# EAGLE design Hydra (EAGLE 6.5.0)
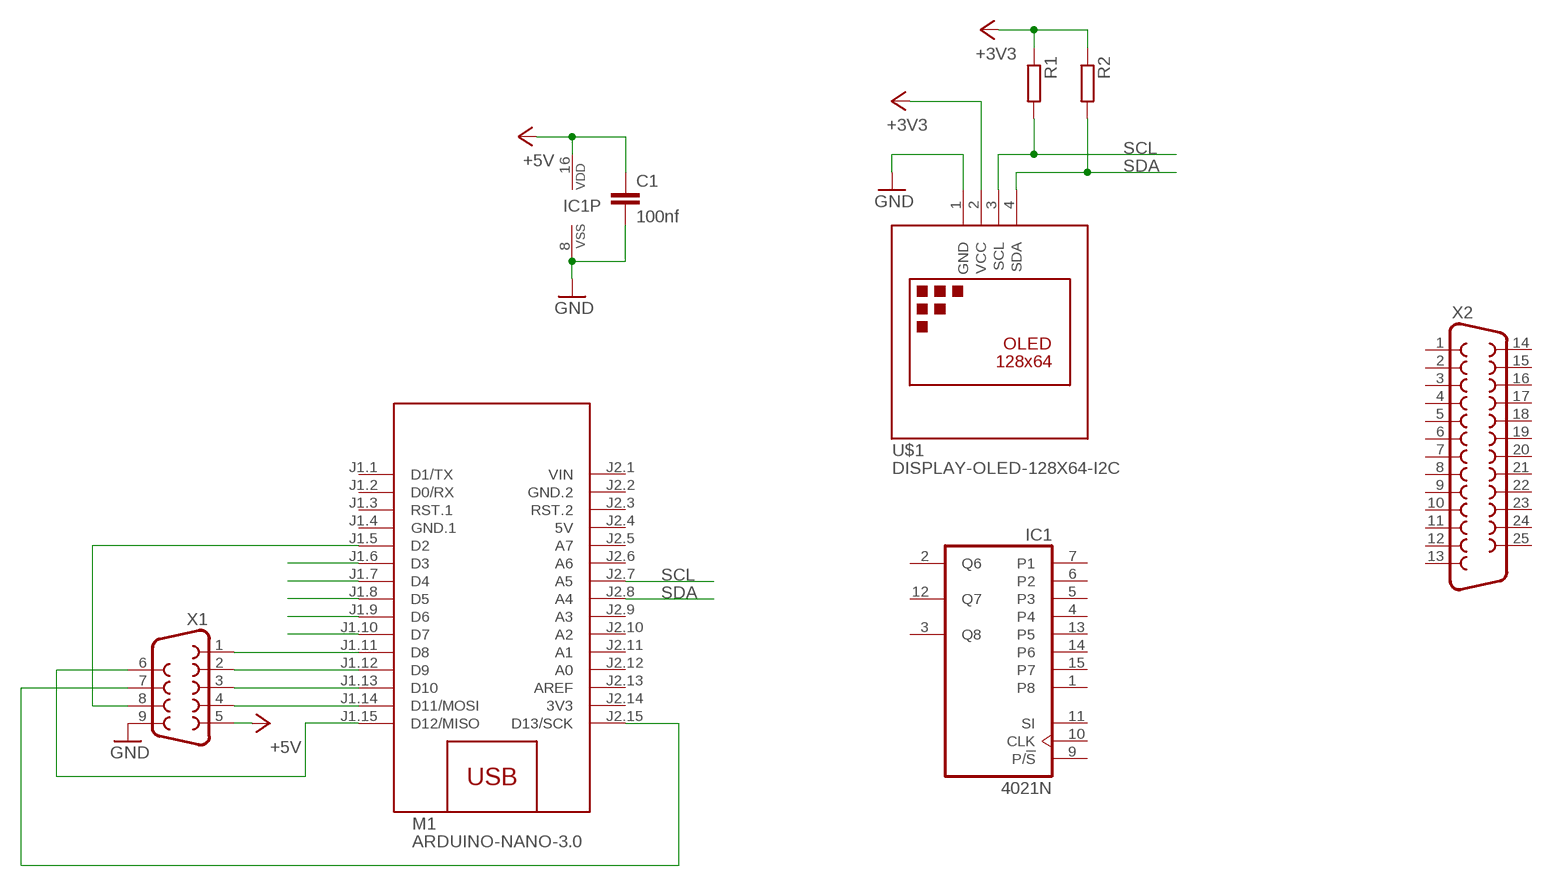
[diagram p0: schematic, sheet 1]

## Parts
C1  100nf  C-EU050-024X044  [C050-024X044]
IC1  4021N  [DIL16]
M1  ARDUINO-NANO-3.0  [ARDUINO-NANO-3.0]
R1  R-EU_0204/5  [0204/5]
R2  R-EU_0204/5  [0204/5]
U$1  DISPLAY-OLED-128X64-I2C  [DISPLAY-OLED-128X64-I2C]
X1  F09D  [F09D]
X2  F25D  [F25D]

## Nets
+3V3: R1.1 R2.1 U$1.2(VCC)
+5V: C1.1 IC1.16(VDD) X1.5
GND: C1.2 IC1.8(VSS) U$1.1(GND) X1.9
N$1: M1.J1.11(D8) X1.1
N$2: M1.J1.12(D9) X1.2
N$3: M1.J1.13(D10) X1.3
N$4: M1.J1.14(D11/MOSI) X1.4
N$5: M1.J1.15(D12/MISO) X1.6
N$6: M1.J2.15(D13/SCK) X1.7
N$7: M1.J1.5(D2) X1.8
N$8: M1.J1.6(D3)
N$9: M1.J1.7(D4)
N$10: M1.J1.8(D5)
N$11: M1.J1.9(D6)
N$12: M1.J1.10(D7)
SCL: M1.J2.7(A5) R1.2 U$1.3(SCL)
SDA: M1.J2.8(A4) R2.2 U$1.4(SDA)
Unconnected: IC1.1(P8) IC1.2(Q6) IC1.3(Q8) IC1.4 IC1.5(P3) IC1.6(P2) IC1.7(P1) IC1.9(P/!S) IC1.10(CLK) IC1.11(SI) IC1.12(Q7) IC1.13(P5) IC1.14(P6) IC1.15(P7) M1.J1.1(D1/TX) M1.J1.2(D0/RX) M1.J1.3(RST.1) M1.J2.3(RST.2) M1.J2.5(A7) M1.J2.6(A6) M1.J2.9(A3) M1.J2.10(A2) M1.J2.11(A1) M1.J2.12(A0) M1.J2.13(AREF) X2.1 X2.2 X2.3 X2.4 X2.5 X2.6 X2.7 X2.8 X2.9 X2.10 X2.11 X2.12 X2.13 X2.14 X2.15 X2.16 X2.17 X2.18 X2.19 X2.20 X2.21 X2.22 X2.23 X2.24 X2.25

## Power pins joined to a net without a drawn wire
3V3: M1.J2.14(3V3)
5V: M1.J2.4(5V)
GND.1: M1.J1.4(GND.1)
GND.2: M1.J2.2(GND.2)
VIN: M1.J2.1(VIN)

## Library data of the parts
C1 = rcl:C-EU: CAPACITOR, European symbol
IC1 = 40xx:4021: 8-bit static SHIFT REGISTER
M1 = diy-modules:ARDUINO-NANO-3.0: Arduino Nano 3.0 and compatible devices More details available here: https://www.arduino.cc/en/Main/ArduinoBoardNano Click here to find device on ebay.com <http://www.ebay.com/sch/arduino+nano>
R1 R2 = rcl:R-EU_: RESISTOR, European symbol
U$1 = diy-modules:DISPLAY-OLED-128X64-I2C: 128x64 Dot Matrix OLED Module based on SSD1306 chip Variant with I2C interface More details available here: http://www.instructables.com/id/Monochrome-096-i2c-OLED-display-with-arduino-SSD13/ SSD1306 datasheet: https://cdn-shop.adafruit.com/datasheets/SSD1306.pdf Click here to find device on ebay.com <http://www.ebay.com/sch/oled+display+128x64+iic> Note: There are two variants: I2C and SPI. Search for the proper version.
X1 = con-subd:F09: SUB-D; OC_FARNELL: unknown; OC_NEWARK: unknown
X2 = con-subd:F25: SUB-D; OC_FARNELL: unknown; OC_NEWARK: unknown

## Board
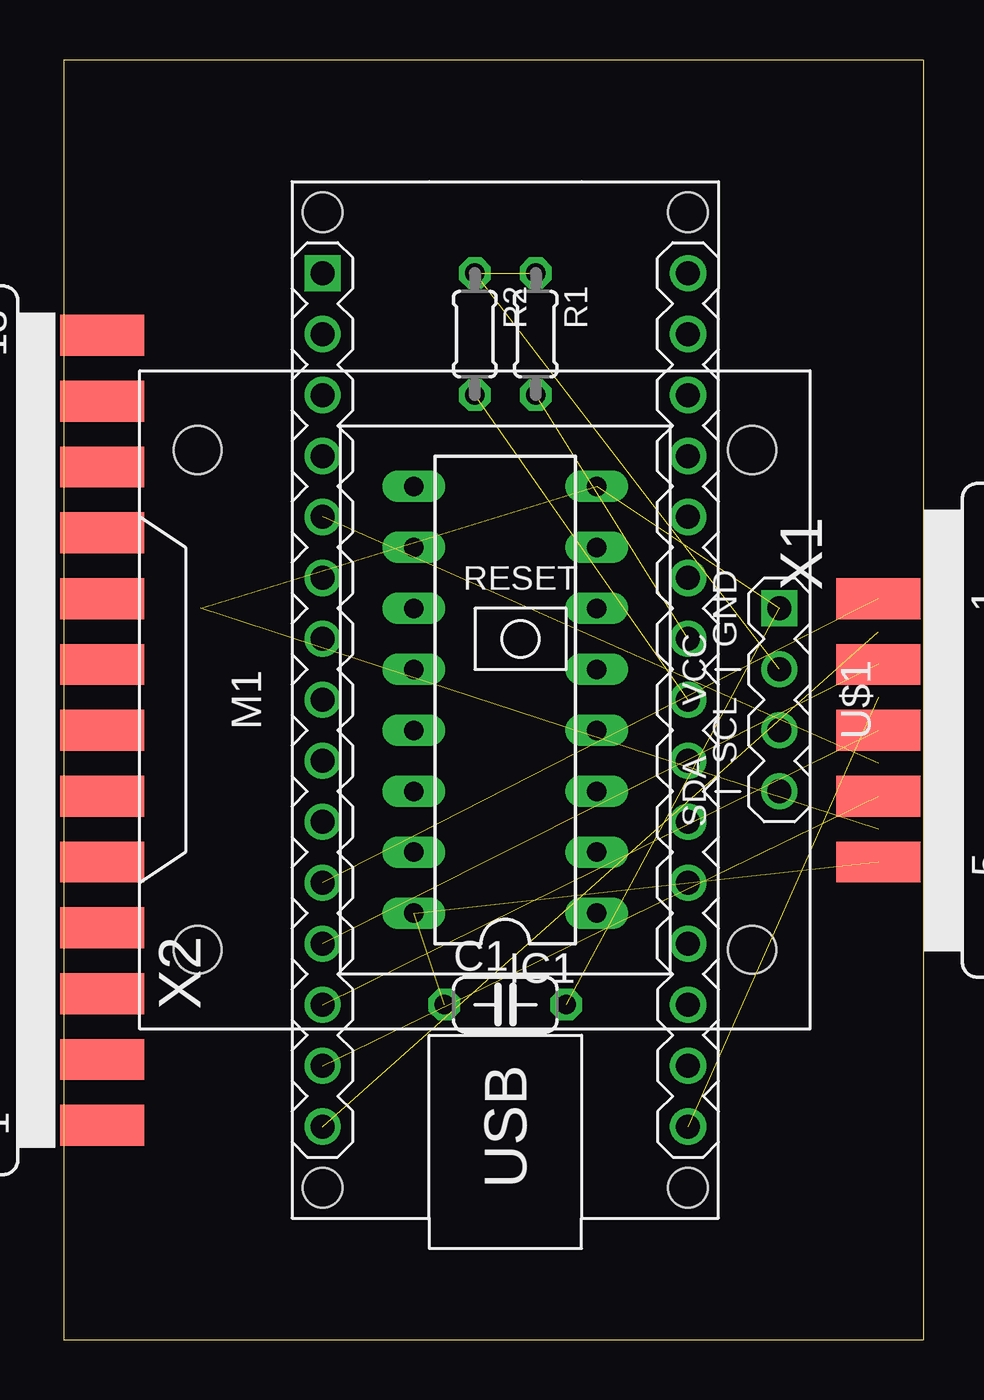
[diagram p1: board, top side]
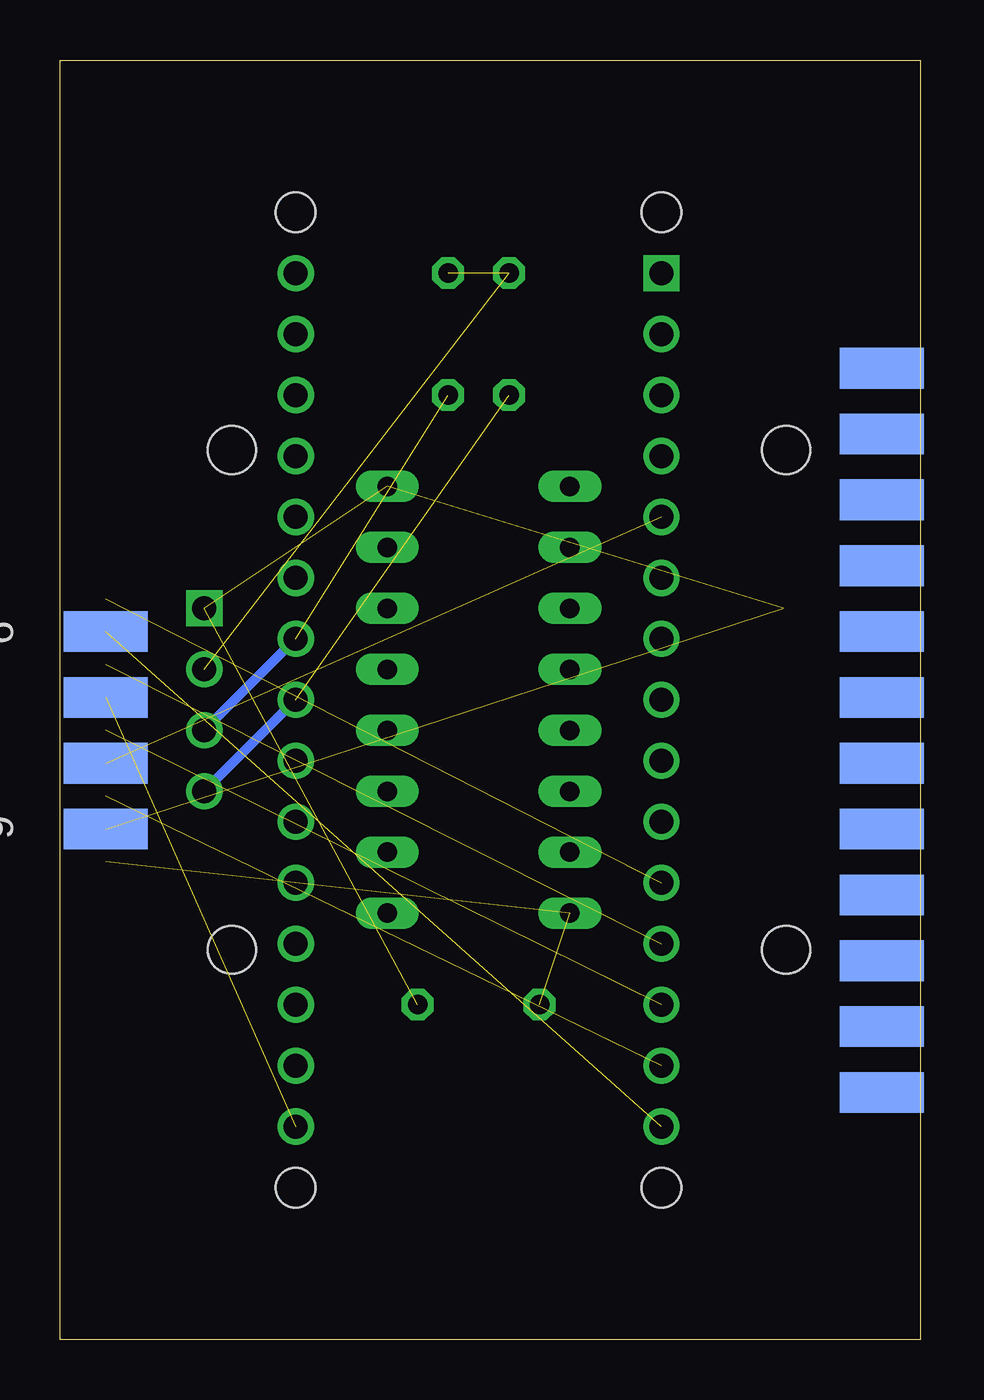
[diagram p2: board, bottom side, seen from below]

Size 35.87 x 53.33 mm. Coordinates in mm from the lower left corner, seen from the top.
Outline: 0,0 35.87,0 35.87,53.33 0,53.33 0,0
Copper layers (1*16): Top 0.035mm / dielectric 1.5mm / Bottom 0.035mm
Design rules "default": minimum track width 10mil, minimum drill 24mil, track to track 8mil, track to pad 8mil, pad to pad 8mil, via to via 8mil, smd to smd 8mil, copper to edge 40mil, drill to drill 8mil, minimum pad ring 10mil, minimum via ring 8mil, stop-mask expansion 4mil, vias tented up to drill 0mil, thermal gap 10mil

### Footprints (pad centres in the part's own frame; a part is rotated, then mirrored left to right if it is on the bottom)
C050-024X044 = drill 0.813 octagon: 1 -2.54,0; 2 2.54,0
DIL16 = drill 0.813 long: 1 -8.89,-3.81; 2 -6.35,-3.81; 3 -3.81,-3.81; 4 -1.27,-3.81; 5 1.27,-3.81; 6 3.81,-3.81; 7 6.35,-3.81; 8 8.89,-3.81; 9 8.89,3.81; 10 6.35,3.81; 11 3.81,3.81; 12 1.27,3.81; 13 -1.27,3.81; 14 -3.81,3.81; 15 -6.35,3.81; 16 -8.89,3.81
ARDUINO-NANO-3.0 = drill 1 square: J1.1 17.78,7.62 | drill 1: J1.2 15.24,7.62; J1.3 12.7,7.62; J1.4 10.16,7.62; J1.5 7.62,7.62; J1.6 5.08,7.62; J1.7 2.54,7.62; J1.8 0,7.62; J1.9 -2.54,7.62; J1.10 -5.08,7.62; J1.11 -7.62,7.62; J1.12 -10.16,7.62; J1.13 -12.7,7.62; J1.14 -15.24,7.62; J1.15 -17.78,7.62; J2.1 17.78,-7.62; J2.2 15.24,-7.62; J2.3 12.7,-7.62; J2.4 10.16,-7.62; J2.5 7.62,-7.62; J2.6 5.08,-7.62; J2.7 2.54,-7.62; J2.8 0,-7.62; J2.9 -2.54,-7.62; J2.10 -5.08,-7.62; J2.11 -7.62,-7.62; J2.12 -10.16,-7.62; J2.13 -12.7,-7.62; J2.14 -15.24,-7.62; J2.15 -17.78,-7.62 | hole 1.651: -20.32,7.62; -20.32,-7.62; 20.32,-7.62; 20.32,7.62
0204/5 = drill 0.813 octagon: 1 -2.54,0; 2 2.54,0
DISPLAY-OLED-128X64-I2C = drill 1 square: 1 -3.81,12.7 | drill 1: 2 -1.27,12.7; 3 1.27,12.7; 4 3.81,12.7 | hole 2: -10.414,11.557; 10.414,11.557; 10.414,-11.557; -10.414,-11.557
F09D = smd 1.7 x 3.5: 1 -5.486,-6.045; 2 -2.743,-6.045; 3 0,-6.045; 4 2.743,-6.045; 5 5.486,-6.045 | smd 1.7 x 3.5 bottom: 6 -4.115,-6.045; 7 -1.372,-6.045; 8 1.372,-6.045; 9 4.115,-6.045
F25D = smd 1.7 x 3.5: 1 -16.459,-6.045; 2 -13.716,-6.045; 3 -10.973,-6.045; 4 -8.23,-6.045; 5 -5.486,-6.045; 6 -2.743,-6.045; 7 0,-6.045; 8 2.743,-6.045; 9 5.486,-6.045; 10 8.23,-6.045; 11 10.973,-6.045; 12 13.716,-6.045; 13 16.459,-6.045 | smd 1.7 x 3.5 bottom: 14 -15.088,-6.045; 15 -12.344,-6.045; 16 -9.601,-6.045; 17 -6.858,-6.045; 18 -4.115,-6.045; 19 -1.372,-6.045; 20 1.372,-6.045; 21 4.115,-6.045; 22 6.858,-6.045; 23 9.601,-6.045; 24 12.344,-6.045; 25 15.088,-6.045

### Placement (x,y rotation side)
C1  18.41,13.97 0 top
IC1  18.41,26.67 90 top
M1  18.41,26.67 90 top
R1  19.68,41.91 270 top
R2  17.14,41.91 270 top
U$1  17.14,26.67 270 top
X1  40,25.4 270 top
X2  -4.45,25.4 90 top

### Tracks (layer width: path | path; a pad name or v marks a point on that pad's centre or on a via)
+3V3  (2 unrouted)
+5V  (2 unrouted)
GND  (4 unrouted)
N$1  (1 unrouted)
N$2  (1 unrouted)
N$3  (1 unrouted)
N$4  (1 unrouted)
N$5  (1 unrouted)
N$6  (1 unrouted)
N$7  (1 unrouted)
SCL  (1 unrouted)
  Bottom 0.406: M1.J2.7 U$1.3
SDA  (1 unrouted)
  Bottom 0.406: M1.J2.8 U$1.4